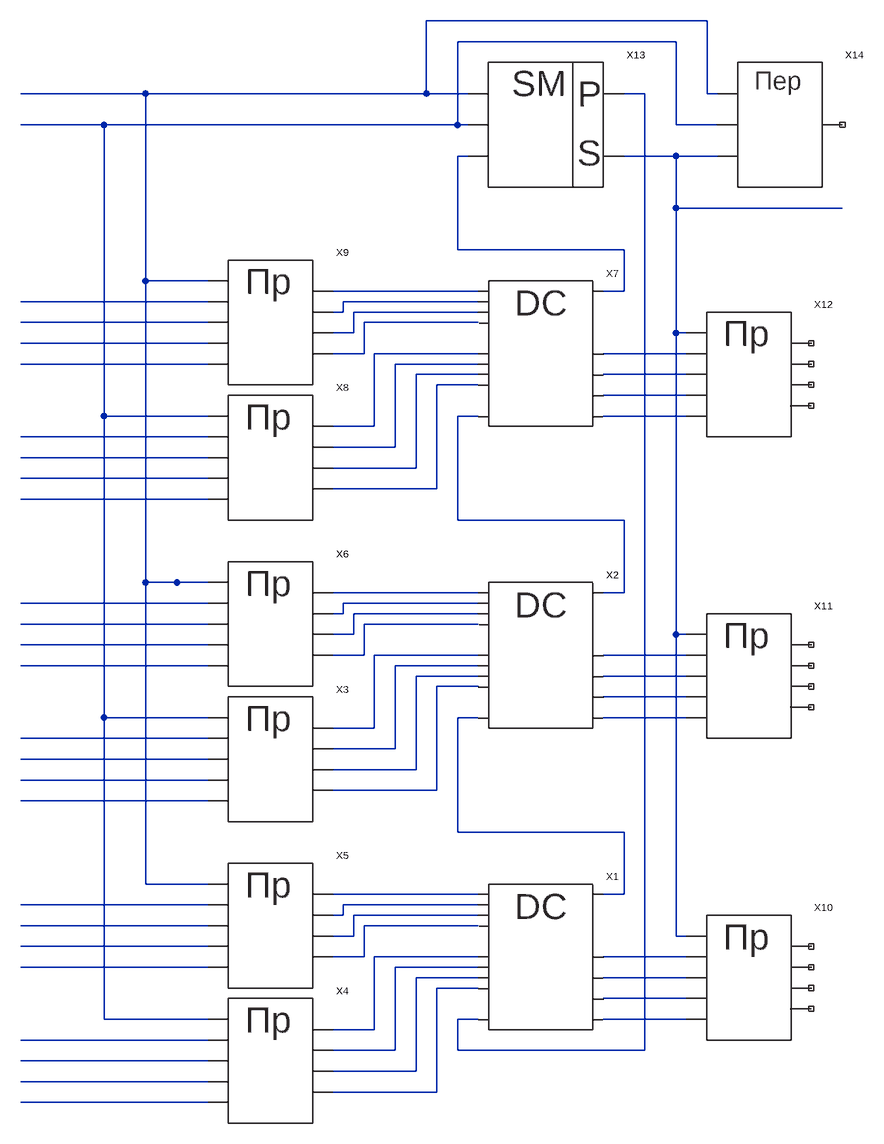
[diagram p0: schematic Draft2.asc]
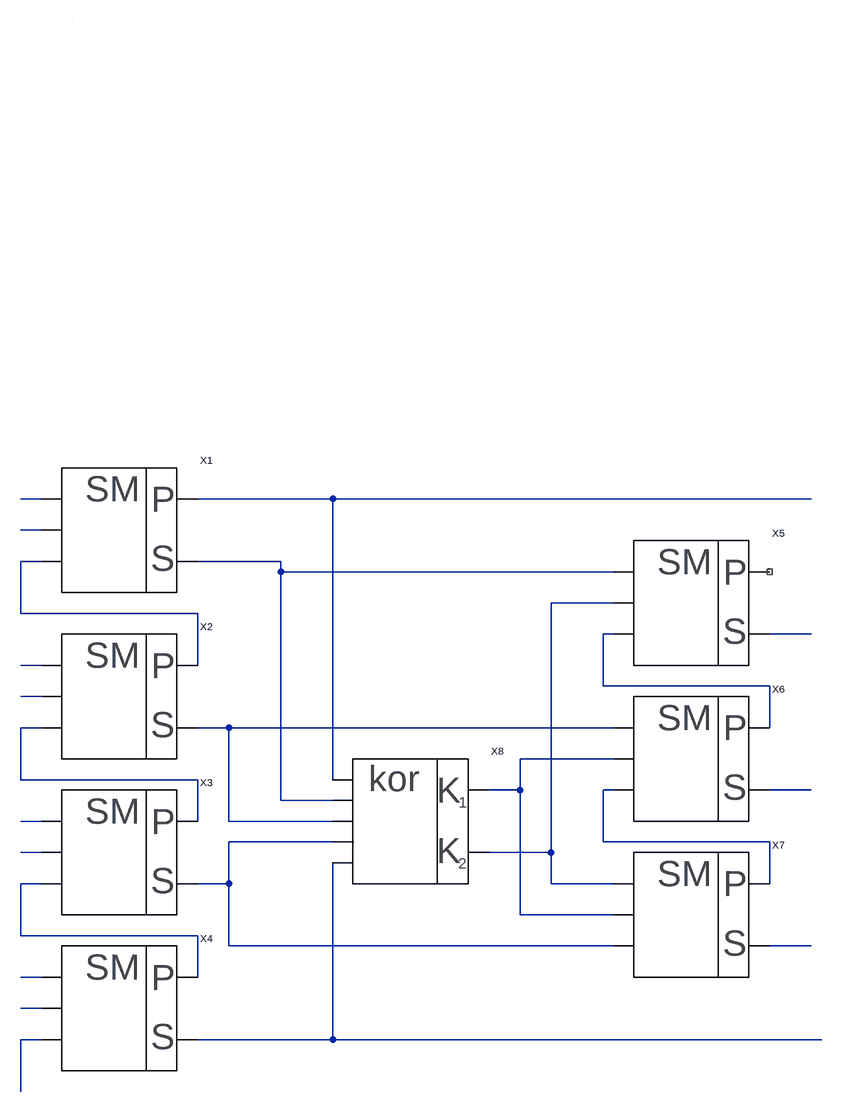
[diagram p1: sub-circuit odnsum.asc]
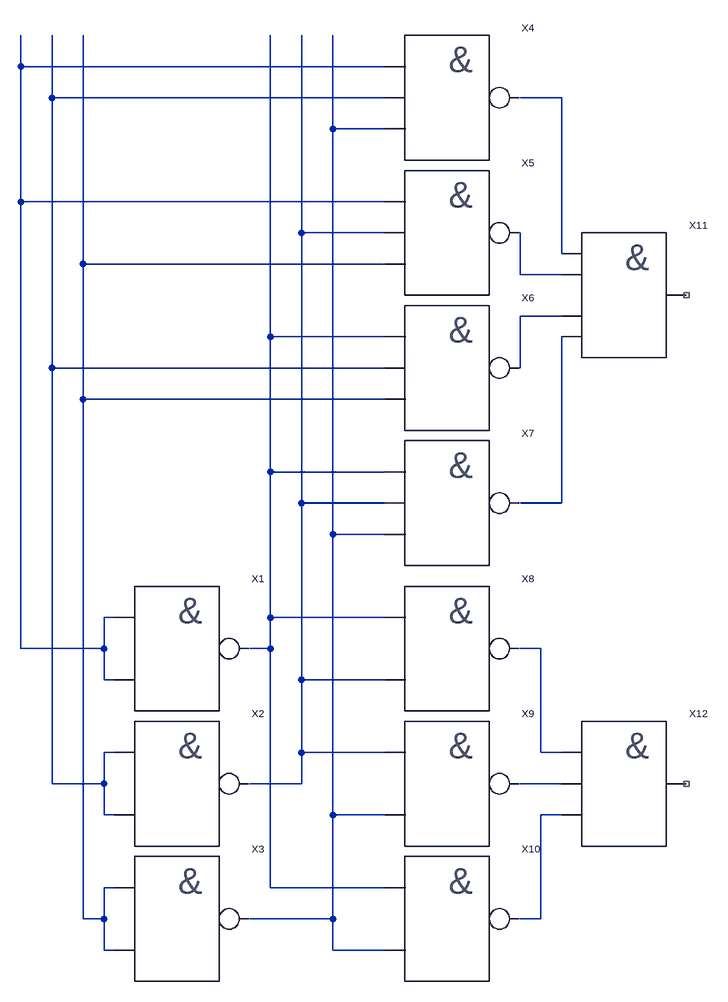
[diagram p2: sub-circuit odndvsum.asc]
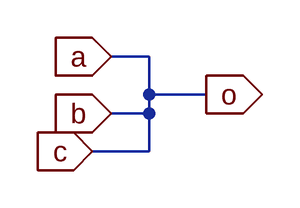
[diagram p3: sub-circuit and3.asc]
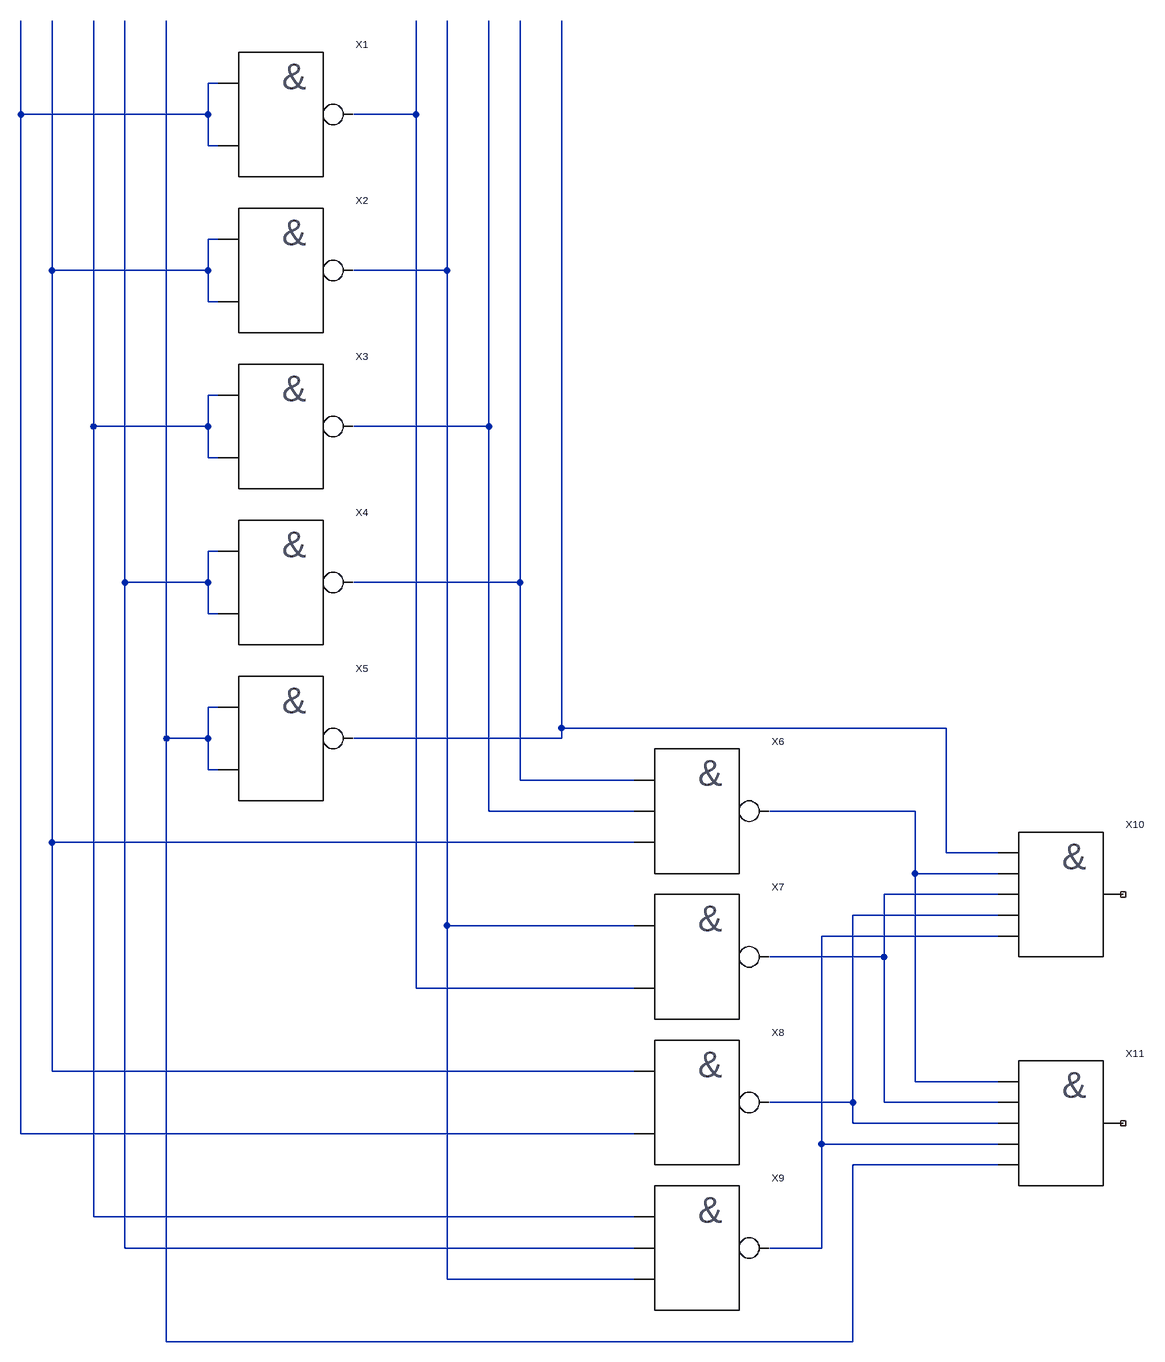
[diagram p4: sub-circuit korr.asc]
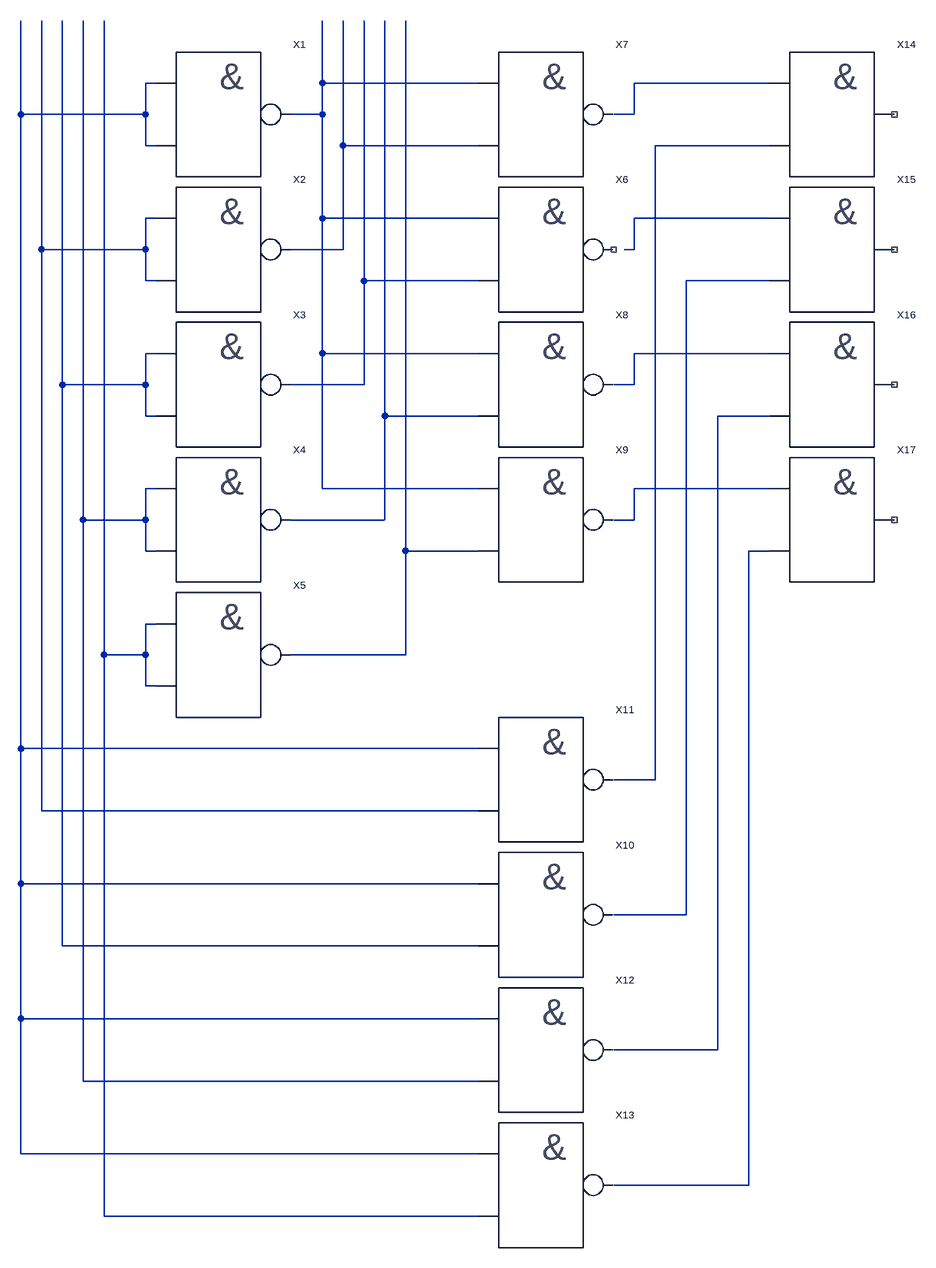
[diagram p5: sub-circuit preobr.asc]
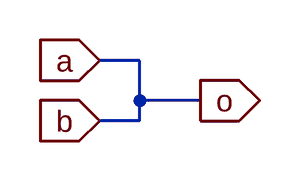
[diagram p6: sub-circuit and2.asc]
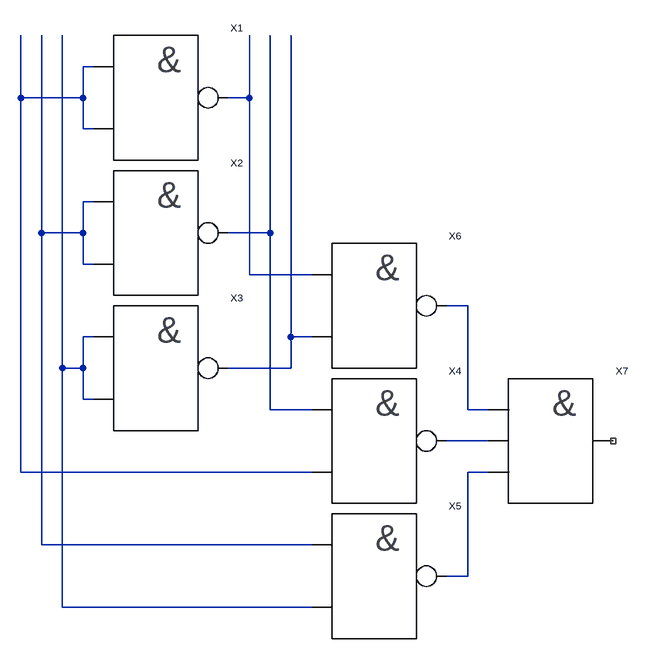
[diagram p7: sub-circuit perep.asc]
Draft2.asc, the LTspice schematic file:
Version 4
SHEET 1 1352 836
WIRE 816 -864 384 -864
WIRE 768 -832 432 -832
WIRE -48 -752 -240 -752
WIRE 384 -752 384 -864
WIRE 384 -752 -48 -752
WIRE 448 -752 384 -752
WIRE 720 -752 688 -752
WIRE 816 -752 816 -864
WIRE 832 -752 816 -752
WIRE -112 -704 -240 -704
WIRE 432 -704 432 -832
WIRE 432 -704 -112 -704
WIRE 448 -704 432 -704
WIRE 768 -704 768 -832
WIRE 832 -704 768 -704
WIRE 448 -656 432 -656
WIRE 768 -656 688 -656
WIRE 832 -656 768 -656
WIRE 768 -576 768 -656
WIRE 1024 -576 768 -576
WIRE 432 -512 432 -656
WIRE 688 -512 432 -512
WIRE -48 -464 -48 -752
WIRE 48 -464 -48 -464
WIRE 464 -448 240 -448
WIRE 688 -448 688 -512
WIRE 688 -448 656 -448
WIRE 48 -432 -240 -432
WIRE 464 -432 256 -432
WIRE 256 -416 256 -432
WIRE 256 -416 240 -416
WIRE 464 -416 272 -416
WIRE 48 -400 -240 -400
WIRE 464 -400 288 -400
WIRE 272 -384 272 -416
WIRE 272 -384 240 -384
WIRE 768 -384 768 -576
WIRE 784 -384 768 -384
WIRE 48 -368 -240 -368
WIRE 288 -352 288 -400
WIRE 288 -352 240 -352
WIRE 464 -352 304 -352
WIRE 784 -352 656 -352
WIRE 48 -336 -240 -336
WIRE 464 -336 336 -336
WIRE 464 -320 368 -320
WIRE 784 -320 656 -320
WIRE 464 -304 400 -304
WIRE 784 -288 656 -288
WIRE -112 -256 -112 -704
WIRE 48 -256 -112 -256
WIRE 464 -256 432 -256
WIRE 784 -256 656 -256
WIRE 304 -240 304 -352
WIRE 304 -240 240 -240
WIRE 48 -224 -240 -224
WIRE 336 -208 336 -336
WIRE 336 -208 240 -208
WIRE 48 -192 -240 -192
WIRE 368 -176 368 -320
WIRE 368 -176 240 -176
WIRE 48 -160 -240 -160
WIRE 400 -144 400 -304
WIRE 400 -144 240 -144
WIRE 48 -128 -240 -128
WIRE 432 -96 432 -256
WIRE 688 -96 432 -96
WIRE -48 0 -48 -464
WIRE 48 0 -48 0
WIRE 464 16 240 16
WIRE 688 16 688 -96
WIRE 688 16 656 16
WIRE 48 32 -240 32
WIRE 464 32 256 32
WIRE 256 48 256 32
WIRE 256 48 240 48
WIRE 464 48 272 48
WIRE 48 64 -240 64
WIRE 464 64 288 64
WIRE 272 80 272 48
WIRE 272 80 240 80
WIRE 768 80 768 -384
WIRE 784 80 768 80
WIRE 48 96 -240 96
WIRE 288 112 288 64
WIRE 288 112 240 112
WIRE 464 112 304 112
WIRE 784 112 656 112
WIRE 48 128 -240 128
WIRE 464 128 336 128
WIRE 464 144 368 144
WIRE 784 144 656 144
WIRE 464 160 400 160
WIRE 784 176 656 176
WIRE -112 208 -112 -256
WIRE 48 208 -112 208
WIRE 464 208 432 208
WIRE 784 208 656 208
WIRE 304 224 304 112
WIRE 304 224 240 224
WIRE 48 240 -240 240
WIRE 336 256 336 128
WIRE 336 256 240 256
WIRE 48 272 -240 272
WIRE 368 288 368 144
WIRE 368 288 240 288
WIRE 48 304 -240 304
WIRE 400 320 400 160
WIRE 400 320 240 320
WIRE 48 336 -240 336
WIRE 432 384 432 208
WIRE 688 384 432 384
WIRE -48 464 -48 0
WIRE 48 464 -48 464
WIRE 464 480 240 480
WIRE 688 480 688 384
WIRE 688 480 656 480
WIRE 48 496 -240 496
WIRE 464 496 256 496
WIRE 256 512 256 496
WIRE 256 512 240 512
WIRE 464 512 272 512
WIRE 48 528 -240 528
WIRE 464 528 288 528
WIRE 272 544 272 512
WIRE 272 544 240 544
WIRE 768 544 768 80
WIRE 784 544 768 544
WIRE 48 560 -240 560
WIRE 288 576 288 528
WIRE 288 576 240 576
WIRE 464 576 304 576
WIRE 784 576 656 576
WIRE 48 592 -240 592
WIRE 464 592 336 592
WIRE 464 608 368 608
WIRE 784 608 656 608
WIRE 464 624 400 624
WIRE 784 640 656 640
WIRE -112 672 -112 208
WIRE 48 672 -112 672
WIRE 464 672 432 672
WIRE 784 672 656 672
WIRE 304 688 304 576
WIRE 304 688 240 688
WIRE 48 704 -240 704
WIRE 336 720 336 592
WIRE 336 720 240 720
WIRE 432 720 432 672
WIRE 720 720 720 -752
WIRE 720 720 432 720
WIRE 48 736 -240 736
WIRE 368 752 368 608
WIRE 368 752 240 752
WIRE 48 768 -240 768
WIRE 400 784 400 624
WIRE 400 784 240 784
WIRE 48 800 -240 800
WIRE 0 0 0 0
SYMBOL odnSum 560 576 R0
SYMATTR InstName X1
SYMBOL preobr 144 736 R0
SYMATTR InstName X4
SYMBOL preobr 144 528 R0
SYMATTR InstName X5
SYMBOL preobr 880 608 R0
SYMATTR InstName X10
SYMBOL odnDvSum 544 -704 R0
SYMATTR InstName X13
SYMBOL perep 928 -704 R0
SYMATTR InstName X14
SYMBOL odnSum 560 112 R0
SYMATTR InstName X2
SYMBOL preobr 144 272 R0
SYMATTR InstName X3
SYMBOL preobr 144 64 R0
SYMATTR InstName X6
SYMBOL odnSum 560 -352 R0
SYMATTR InstName X7
SYMBOL preobr 144 -192 R0
SYMATTR InstName X8
SYMBOL preobr 144 -400 R0
SYMATTR InstName X9
SYMBOL preobr 880 144 R0
SYMATTR InstName X11
SYMBOL preobr 880 -320 R0
SYMATTR InstName X12

odnsum.asc, the sub-circuit schematic file:
Version 4
SHEET 1 1524 2164
WIRE -48 736 -80 736
WIRE 400 736 192 736
WIRE 1136 736 400 736
WIRE -48 784 -80 784
WIRE -48 832 -80 832
WIRE 320 832 192 832
WIRE 320 848 320 832
WIRE 832 848 320 848
WIRE 832 896 736 896
WIRE -80 912 -80 832
WIRE 192 912 -80 912
WIRE 832 944 816 944
WIRE 1136 944 1072 944
WIRE -48 992 -80 992
WIRE 192 992 192 912
WIRE 816 1024 816 944
WIRE 1072 1024 816 1024
WIRE -48 1040 -80 1040
WIRE -48 1088 -80 1088
WIRE 240 1088 192 1088
WIRE 832 1088 240 1088
WIRE 1072 1088 1072 1024
WIRE 832 1136 688 1136
WIRE -80 1168 -80 1088
WIRE 192 1168 -80 1168
WIRE 400 1168 400 736
WIRE 688 1184 688 1136
WIRE 688 1184 640 1184
WIRE 832 1184 816 1184
WIRE 1136 1184 1072 1184
WIRE 320 1200 320 848
WIRE 400 1200 320 1200
WIRE -48 1232 -80 1232
WIRE 192 1232 192 1168
WIRE 240 1232 240 1088
WIRE 400 1232 240 1232
WIRE 400 1264 240 1264
WIRE 816 1264 816 1184
WIRE 1072 1264 816 1264
WIRE -48 1280 -80 1280
WIRE 736 1280 736 896
WIRE 736 1280 640 1280
WIRE -48 1328 -80 1328
WIRE 240 1328 240 1264
WIRE 240 1328 192 1328
WIRE 736 1328 736 1280
WIRE 832 1328 736 1328
WIRE 1072 1328 1072 1264
WIRE 688 1376 688 1184
WIRE 832 1376 688 1376
WIRE -80 1408 -80 1328
WIRE 192 1408 -80 1408
WIRE 240 1424 240 1328
WIRE 832 1424 240 1424
WIRE 1136 1424 1072 1424
WIRE -48 1472 -80 1472
WIRE 192 1472 192 1408
WIRE -48 1520 -80 1520
WIRE -48 1568 -80 1568
WIRE 400 1568 400 1296
WIRE 400 1568 192 1568
WIRE 1152 1568 400 1568
WIRE -80 1648 -80 1568
WIRE 0 0 0 0
SYMBOL odnDvSum 48 784 R0
SYMATTR InstName X1
SYMBOL odnDvSum 48 1040 R0
SYMATTR InstName X2
SYMBOL odnDvSum 48 1520 R0
SYMATTR InstName X4
SYMBOL odnDvSum 928 896 R0
SYMATTR InstName X5
SYMBOL odnDvSum 928 1136 R0
SYMATTR InstName X6
SYMBOL odnDvSum 928 1376 R0
SYMATTR InstName X7
SYMBOL korr 496 1232 R0
SYMATTR InstName X8
SYMBOL odnDvSum 48 1280 R0
SYMATTR InstName X3

odndvsum.asc, the sub-circuit schematic file:
Version 4
SHEET 1 1032 2164
WIRE -16 752 -16 704
WIRE 544 752 -16 752
WIRE 32 800 32 704
WIRE 544 800 32 800
WIRE 816 800 752 800
WIRE 464 848 464 704
WIRE 544 848 464 848
WIRE -16 960 -16 752
WIRE 544 960 -16 960
WIRE 416 1008 416 704
WIRE 544 1008 416 1008
WIRE 816 1040 816 800
WIRE 80 1056 80 704
WIRE 544 1056 80 1056
WIRE 752 1072 752 1008
WIRE 816 1072 752 1072
WIRE 816 1136 752 1136
WIRE 368 1168 368 704
WIRE 544 1168 368 1168
WIRE 32 1216 32 800
WIRE 544 1216 32 1216
WIRE 752 1216 752 1136
WIRE 80 1264 80 1056
WIRE 544 1264 80 1264
WIRE 368 1376 368 1168
WIRE 544 1376 368 1376
WIRE 416 1424 416 1008
WIRE 544 1424 416 1424
WIRE 816 1424 816 1168
WIRE 816 1424 752 1424
WIRE 464 1472 464 848
WIRE 544 1472 464 1472
WIRE 128 1600 112 1600
WIRE 368 1600 368 1376
WIRE 544 1600 368 1600
WIRE -16 1648 -16 960
WIRE 112 1648 112 1600
WIRE 112 1648 -16 1648
WIRE 368 1648 368 1600
WIRE 368 1648 336 1648
WIRE 784 1648 752 1648
WIRE 112 1696 112 1648
WIRE 128 1696 112 1696
WIRE 416 1696 416 1424
WIRE 544 1696 416 1696
WIRE 128 1808 112 1808
WIRE 416 1808 416 1696
WIRE 544 1808 416 1808
WIRE 784 1808 784 1648
WIRE 816 1808 784 1808
WIRE 32 1856 32 1216
WIRE 112 1856 112 1808
WIRE 112 1856 32 1856
WIRE 416 1856 416 1808
WIRE 416 1856 336 1856
WIRE 816 1856 752 1856
WIRE 112 1904 112 1856
WIRE 128 1904 112 1904
WIRE 464 1904 464 1472
WIRE 544 1904 464 1904
WIRE 816 1904 784 1904
WIRE 128 2016 112 2016
WIRE 368 2016 368 1648
WIRE 544 2016 368 2016
WIRE 80 2064 80 1264
WIRE 112 2064 112 2016
WIRE 112 2064 80 2064
WIRE 464 2064 464 1904
WIRE 464 2064 336 2064
WIRE 784 2064 784 1904
WIRE 784 2064 752 2064
WIRE 112 2112 112 2064
WIRE 128 2112 112 2112
WIRE 464 2112 464 2064
WIRE 544 2112 464 2112
SYMBOL NAND2 224 1648 R0
SYMATTR InstName X1
SYMBOL NAND2 224 1856 R0
SYMATTR InstName X2
SYMBOL NAND2 224 2064 R0
SYMATTR InstName X3
SYMBOL NAND3 640 800 R0
SYMATTR InstName X4
SYMBOL NAND3 640 1008 R0
SYMATTR InstName X5
SYMBOL NAND3 640 1216 R0
SYMATTR InstName X6
SYMBOL NAND3 640 1424 R0
SYMATTR InstName X7
SYMBOL NAND2 640 1648 R0
SYMATTR InstName X8
SYMBOL NAND2 640 1856 R0
SYMATTR InstName X9
SYMBOL NAND2 640 2064 R0
SYMATTR InstName X10
SYMBOL AND4 912 1104 R0
SYMATTR InstName X11
SYMBOL AND3 912 1856 R0
SYMATTR InstName X12

and3.asc, the sub-circuit schematic file:
Version 4
SHEET 1 880 680
WIRE 96 80 64 80
WIRE 96 112 96 80
WIRE 144 112 96 112
WIRE 96 128 96 112
WIRE 96 128 64 128
WIRE 96 160 96 128
WIRE 96 160 48 160
FLAG 64 80 a
IOPIN 64 80 In
FLAG 64 128 b
IOPIN 64 128 In
FLAG 144 112 o
IOPIN 144 112 Out
FLAG 48 160 c
IOPIN 48 160 In

korr.asc, the sub-circuit schematic file:
Version 4
SHEET 1 1336 2548
WIRE -64 528 -80 528
WIRE -368 576 -368 432
WIRE -80 576 -80 528
WIRE -80 576 -368 576
WIRE 240 576 240 432
WIRE 240 576 144 576
WIRE -80 624 -80 576
WIRE -64 624 -80 624
WIRE -64 768 -80 768
WIRE -320 816 -320 432
WIRE -80 816 -80 768
WIRE -80 816 -320 816
WIRE 288 816 288 432
WIRE 288 816 144 816
WIRE -80 864 -80 816
WIRE -64 864 -80 864
WIRE -64 1008 -80 1008
WIRE -256 1056 -256 432
WIRE -80 1056 -80 1008
WIRE -80 1056 -256 1056
WIRE 352 1056 352 432
WIRE 352 1056 144 1056
WIRE -80 1104 -80 1056
WIRE -64 1104 -80 1104
WIRE -64 1248 -80 1248
WIRE -208 1296 -208 432
WIRE -80 1296 -80 1248
WIRE -80 1296 -208 1296
WIRE 400 1296 400 432
WIRE 400 1296 144 1296
WIRE -80 1344 -80 1296
WIRE -64 1344 -80 1344
WIRE -64 1488 -80 1488
WIRE 464 1520 464 432
WIRE 1056 1520 464 1520
WIRE -144 1536 -144 432
WIRE -80 1536 -80 1488
WIRE -80 1536 -144 1536
WIRE 464 1536 464 1520
WIRE 464 1536 144 1536
WIRE -80 1584 -80 1536
WIRE -64 1584 -80 1584
WIRE 400 1600 400 1296
WIRE 576 1600 400 1600
WIRE 352 1648 352 1056
WIRE 576 1648 352 1648
WIRE 1008 1648 784 1648
WIRE -320 1696 -320 816
WIRE 576 1696 -320 1696
WIRE 1056 1712 1056 1520
WIRE 1136 1712 1056 1712
WIRE 1008 1744 1008 1648
WIRE 1136 1744 1008 1744
WIRE 1136 1776 960 1776
WIRE 1136 1808 912 1808
WIRE 288 1824 288 816
WIRE 576 1824 288 1824
WIRE 1136 1840 864 1840
WIRE 960 1872 960 1776
WIRE 960 1872 784 1872
WIRE 240 1920 240 576
WIRE 576 1920 240 1920
WIRE -320 2048 -320 1696
WIRE 576 2048 -320 2048
WIRE 1008 2064 1008 1744
WIRE 1136 2064 1008 2064
WIRE 912 2096 912 1808
WIRE 912 2096 784 2096
WIRE 960 2096 960 1872
WIRE 1136 2096 960 2096
WIRE 912 2128 912 2096
WIRE 1136 2128 912 2128
WIRE -368 2144 -368 576
WIRE 576 2144 -368 2144
WIRE 864 2160 864 1840
WIRE 1136 2160 864 2160
WIRE 1136 2192 912 2192
WIRE -256 2272 -256 1056
WIRE 576 2272 -256 2272
WIRE -208 2320 -208 1296
WIRE 576 2320 -208 2320
WIRE 864 2320 864 2160
WIRE 864 2320 784 2320
WIRE 288 2368 288 1824
WIRE 576 2368 288 2368
WIRE -144 2464 -144 1536
WIRE 912 2464 912 2192
WIRE 912 2464 -144 2464
SYMBOL NAND2 32 576 R0
SYMATTR InstName X1
SYMBOL NAND2 32 816 R0
SYMATTR InstName X2
SYMBOL NAND2 32 1296 R0
SYMATTR InstName X4
SYMBOL NAND2 32 1536 R0
SYMATTR InstName X5
SYMBOL NAND3 672 1648 R0
SYMATTR InstName X6
SYMBOL NAND2 672 1872 R0
SYMATTR InstName X7
SYMBOL NAND2 672 2096 R0
SYMATTR InstName X8
SYMBOL NAND3 672 2320 R0
SYMATTR InstName X9
SYMBOL AND5 1232 1776 R0
SYMATTR InstName X10
SYMBOL AND5 1232 2128 R0
SYMATTR InstName X11
SYMBOL NAND2 32 1056 R0
SYMATTR InstName X3

preobr.asc, the sub-circuit schematic file:
Version 4
SHEET 1 1400 1444
WIRE 256 -368 240 -368
WIRE 512 -368 512 -464
WIRE 752 -368 512 -368
WIRE 1200 -368 992 -368
WIRE 48 -320 48 -464
WIRE 240 -320 240 -368
WIRE 240 -320 48 -320
WIRE 512 -320 512 -368
WIRE 512 -320 464 -320
WIRE 992 -320 992 -368
WIRE 992 -320 960 -320
WIRE 240 -272 240 -320
WIRE 256 -272 240 -272
WIRE 544 -272 544 -464
WIRE 752 -272 544 -272
WIRE 1200 -272 1024 -272
WIRE 256 -160 240 -160
WIRE 512 -160 512 -320
WIRE 752 -160 512 -160
WIRE 1200 -160 992 -160
WIRE 80 -112 80 -464
WIRE 240 -112 240 -160
WIRE 240 -112 80 -112
WIRE 544 -112 544 -272
WIRE 544 -112 464 -112
WIRE 992 -112 992 -160
WIRE 992 -112 976 -112
WIRE 240 -64 240 -112
WIRE 256 -64 240 -64
WIRE 576 -64 576 -464
WIRE 752 -64 576 -64
WIRE 1200 -64 1072 -64
WIRE 256 48 240 48
WIRE 512 48 512 -160
WIRE 752 48 512 48
WIRE 1200 48 992 48
WIRE 112 96 112 -464
WIRE 240 96 240 48
WIRE 240 96 112 96
WIRE 576 96 576 -64
WIRE 576 96 464 96
WIRE 992 96 992 48
WIRE 992 96 960 96
WIRE 240 144 240 96
WIRE 256 144 240 144
WIRE 608 144 608 -464
WIRE 752 144 608 144
WIRE 1200 144 1120 144
WIRE 256 256 240 256
WIRE 512 256 512 48
WIRE 752 256 512 256
WIRE 1200 256 992 256
WIRE 144 304 144 -464
WIRE 240 304 240 256
WIRE 240 304 144 304
WIRE 608 304 608 144
WIRE 608 304 464 304
WIRE 992 304 992 256
WIRE 992 304 960 304
WIRE 240 352 240 304
WIRE 256 352 240 352
WIRE 640 352 640 -464
WIRE 752 352 640 352
WIRE 1200 352 1168 352
WIRE 256 464 240 464
WIRE 176 512 176 -464
WIRE 240 512 240 464
WIRE 240 512 176 512
WIRE 640 512 640 352
WIRE 640 512 464 512
WIRE 240 560 240 512
WIRE 256 560 240 560
WIRE 48 656 48 -320
WIRE 752 656 48 656
WIRE 1024 704 1024 -272
WIRE 1024 704 960 704
WIRE 80 752 80 -112
WIRE 752 752 80 752
WIRE 48 864 48 656
WIRE 752 864 48 864
WIRE 1072 912 1072 -64
WIRE 1072 912 960 912
WIRE 112 960 112 96
WIRE 752 960 112 960
WIRE 48 1072 48 864
WIRE 752 1072 48 1072
WIRE 1120 1120 1120 144
WIRE 1120 1120 960 1120
WIRE 144 1168 144 304
WIRE 752 1168 144 1168
WIRE 48 1280 48 1072
WIRE 752 1280 48 1280
WIRE 1168 1328 1168 352
WIRE 1168 1328 960 1328
WIRE 176 1376 176 512
WIRE 752 1376 176 1376
SYMBOL NAND2 352 -112 R0
SYMATTR InstName X2
SYMBOL NAND2 352 -320 R0
SYMATTR InstName X1
SYMBOL NAND2 352 96 R0
SYMATTR InstName X3
SYMBOL NAND2 352 304 R0
SYMATTR InstName X4
SYMBOL NAND2 352 512 R0
SYMATTR InstName X5
SYMBOL NAND2 848 -112 R0
SYMATTR InstName X6
SYMBOL NAND2 848 -320 R0
SYMATTR InstName X7
SYMBOL NAND2 848 96 R0
SYMATTR InstName X8
SYMBOL NAND2 848 304 R0
SYMATTR InstName X9
SYMBOL NAND2 848 912 R0
SYMATTR InstName X10
SYMBOL NAND2 848 704 R0
SYMATTR InstName X11
SYMBOL NAND2 848 1120 R0
SYMATTR InstName X12
SYMBOL NAND2 848 1328 R0
SYMATTR InstName X13
SYMBOL AND2 1296 -320 R0
SYMATTR InstName X14
SYMBOL AND2 1296 -112 R0
SYMATTR InstName X15
SYMBOL AND2 1296 96 R0
SYMATTR InstName X16
SYMBOL AND2 1296 304 R0
SYMATTR InstName X17

and2.asc, the sub-circuit schematic file:
Version 4
SHEET 1 880 680
WIRE 96 80 64 80
WIRE 96 112 96 80
WIRE 144 112 96 112
WIRE 96 128 96 112
WIRE 96 128 64 128
FLAG 64 80 a
IOPIN 64 80 In
FLAG 64 128 b
IOPIN 64 128 In
FLAG 144 112 o
IOPIN 144 112 Out

perep.asc, the sub-circuit schematic file:
Version 4
SHEET 1 880 916
WIRE -48 -48 -64 -48
WIRE -160 0 -160 -96
WIRE -64 0 -64 -48
WIRE -64 0 -160 0
WIRE 192 0 192 -96
WIRE 192 0 160 0
WIRE -64 48 -64 0
WIRE -48 48 -64 48
WIRE -48 160 -64 160
WIRE -128 208 -128 -96
WIRE -64 208 -64 160
WIRE -64 208 -128 208
WIRE 224 208 224 -96
WIRE 224 208 160 208
WIRE -64 256 -64 208
WIRE -48 256 -64 256
WIRE 192 272 192 0
WIRE 288 272 192 272
WIRE 528 320 496 320
WIRE -48 368 -64 368
WIRE 256 368 256 -96
WIRE 288 368 256 368
WIRE -96 416 -96 -96
WIRE -64 416 -64 368
WIRE -64 416 -96 416
WIRE 256 416 256 368
WIRE 256 416 160 416
WIRE -64 464 -64 416
WIRE -48 464 -64 464
WIRE 224 480 224 208
WIRE 288 480 224 480
WIRE 528 480 528 320
WIRE 560 480 528 480
WIRE 560 528 496 528
WIRE -160 576 -160 0
WIRE 288 576 -160 576
WIRE 560 576 528 576
WIRE -128 688 -128 208
WIRE 288 688 -128 688
WIRE 528 736 528 576
WIRE 528 736 496 736
WIRE -96 784 -96 416
WIRE 288 784 -96 784
SYMBOL NAND2 48 0 R0
SYMATTR InstName X1
SYMBOL NAND2 48 208 R0
SYMATTR InstName X2
SYMBOL NAND2 48 416 R0
SYMATTR InstName X3
SYMBOL NAND2 384 528 R0
SYMATTR InstName X4
SYMBOL NAND2 384 736 R0
SYMATTR InstName X5
SYMBOL NAND2 384 320 R0
SYMATTR InstName X6
SYMBOL AND3 656 528 R0
SYMATTR InstName X7

The netlist it stands for:
* Draft2.asc
XX1 N048 N050 N051 N053 N055 N058 N059 N061 N003 N042 N056 N060 N062 N063 odnsum
XX4 N002 N067 N055 N064 N066 N065 N058 N059 N061 preobr
XX5 N001 N057 N048 N049 N054 N052 N050 N051 N053 preobr
XX10 N005 N063 NC_01 N056 N062 N060 NC_02 NC_03 NC_04 preobr
XX13 N001 N002 N004 N003 N005 odndvsum
XX14 N001 N005 NC_05 N002 perep
XX2 N027 N029 N030 N032 N034 N037 N038 N040 N042 N021 N035 N039 N041 N043 odnsum
XX3 N002 N047 N034 N044 N046 N045 N037 N038 N040 preobr
XX6 N001 N036 N027 N028 N033 N031 N029 N030 N032 preobr
XX7 N006 N008 N009 N011 N013 N016 N017 N019 N021 N004 N014 N018 N020 N022 odnsum
XX8 N002 N026 N013 N023 N025 N024 N016 N017 N019 preobr
XX9 N001 N015 N006 N007 N012 N010 N008 N009 N011 preobr
XX11 N005 N043 NC_06 N035 N041 N039 NC_07 NC_08 NC_09 preobr
XX12 N005 N022 NC_10 N014 N020 N018 NC_11 NC_12 NC_13 preobr

* block symbol definitions
.subckt odnsum a4 a3 a2 a1 b4 b3 b2 b1 P-1 P y4 y3 y2 y1
XX1 N001 N003 N004 N002 N005 odndvsum
XX2 N009 N010 N011 N004 N012 odndvsum
XX4 N021 N022 N023 N019 N024 odndvsum
XX5 N005 N006 N007 NC_01 N008 odndvsum
XX6 N012 N013 N014 N007 N015 odndvsum
XX7 N006 N013 N017 N014 N020 odndvsum
XX8 N002 N005 N012 N017 N024 N013 N006 korr
XX3 N016 N018 N019 N011 N017 odndvsum
.ends odnsum

.subckt odndvsum a b c S M
XX1 N001 N001 N009 NAND2  ; pins a b o
XX2 N002 N002 N005 NAND2  ; pins a b o
XX3 N006 N006 N004 NAND2  ; pins a b o
XX4 N001 N004 N003 N002 NAND3  ; pins a b o c
XX5 N001 N006 N007 N005 NAND3  ; pins a b o c
XX6 N009 N006 N008 N002 NAND3  ; pins a b o c
XX7 N009 N004 N010 N005 NAND3  ; pins a b o c
XX8 N009 N005 N011 NAND2  ; pins a b o
XX9 N005 N004 N012 NAND2  ; pins a b o
XX10 N009 N004 N013 NAND2  ; pins a b o
XX11 N003 N010 NC_01 N007 N008 AND4  ; pins a b o c d
XX12 N011 N013 NC_02 N012 and3
.ends odndvsum

.subckt and3 a b o c
.ends and3

.subckt korr q1 q2 q3 q4 p k1 k2
XX1 N001 N001 N002 NAND2  ; pins a b o
XX2 N003 N003 N004 NAND2  ; pins a b o
XX4 N007 N007 N008 NAND2  ; pins a b o
XX5 N009 N009 N010 NAND2  ; pins a b o
XX6 N008 N003 N011 N006 NAND3  ; pins a b o c
XX7 N004 N002 N012 NAND2  ; pins a b o
XX8 N003 N001 N013 NAND2  ; pins a b o
XX9 N005 N004 N014 N007 NAND3  ; pins a b o c
XX10 N010 N014 NC_01 N011 N013 N012 AND5  ; pins a b o c d e
XX11 N011 N009 NC_02 N012 N014 N013 AND5  ; pins a b o c d e
XX3 N005 N005 N006 NAND2  ; pins a b o
.ends korr

.subckt preobr a b ф4 c d e ф3 ф2 ф1
XX2 N006 N006 N004 NAND2  ; pins a b o
XX1 N001 N001 N002 NAND2  ; pins a b o
XX3 N010 N010 N008 NAND2  ; pins a b o
XX4 N014 N014 N012 NAND2  ; pins a b o
XX5 N018 N018 N016 NAND2  ; pins a b o
XX6 N002 N008 NC_01 NAND2  ; pins a b o
XX7 N002 N004 N003 NAND2  ; pins a b o
XX8 N002 N012 N011 NAND2  ; pins a b o
XX9 N002 N016 N015 NAND2  ; pins a b o
XX10 N001 N010 N009 NAND2  ; pins a b o
XX11 N001 N006 N005 NAND2  ; pins a b o
XX12 N001 N014 N013 NAND2  ; pins a b o
XX13 N001 N018 N017 NAND2  ; pins a b o
XX14 N003 N005 NC_02 and2
XX15 N007 N009 NC_03 and2
XX16 N011 N013 NC_04 and2
XX17 N015 N017 NC_05 and2
.ends preobr

.subckt and2 a b o
.ends and2

.subckt perep a b o c
XX1 N001 N001 N002 NAND2  ; pins a b o
XX2 N003 N003 N004 NAND2  ; pins a b o
XX3 N006 N006 N007 NAND2  ; pins a b o
XX4 N004 N001 N008 NAND2  ; pins a b o
XX5 N003 N006 N009 NAND2  ; pins a b o
XX6 N002 N007 N005 NAND2  ; pins a b o
XX7 N005 N009 NC_01 N008 and3
.ends perep

.backanno
.end